# EAGLE design notes2d2 (EAGLE 9.4.1)
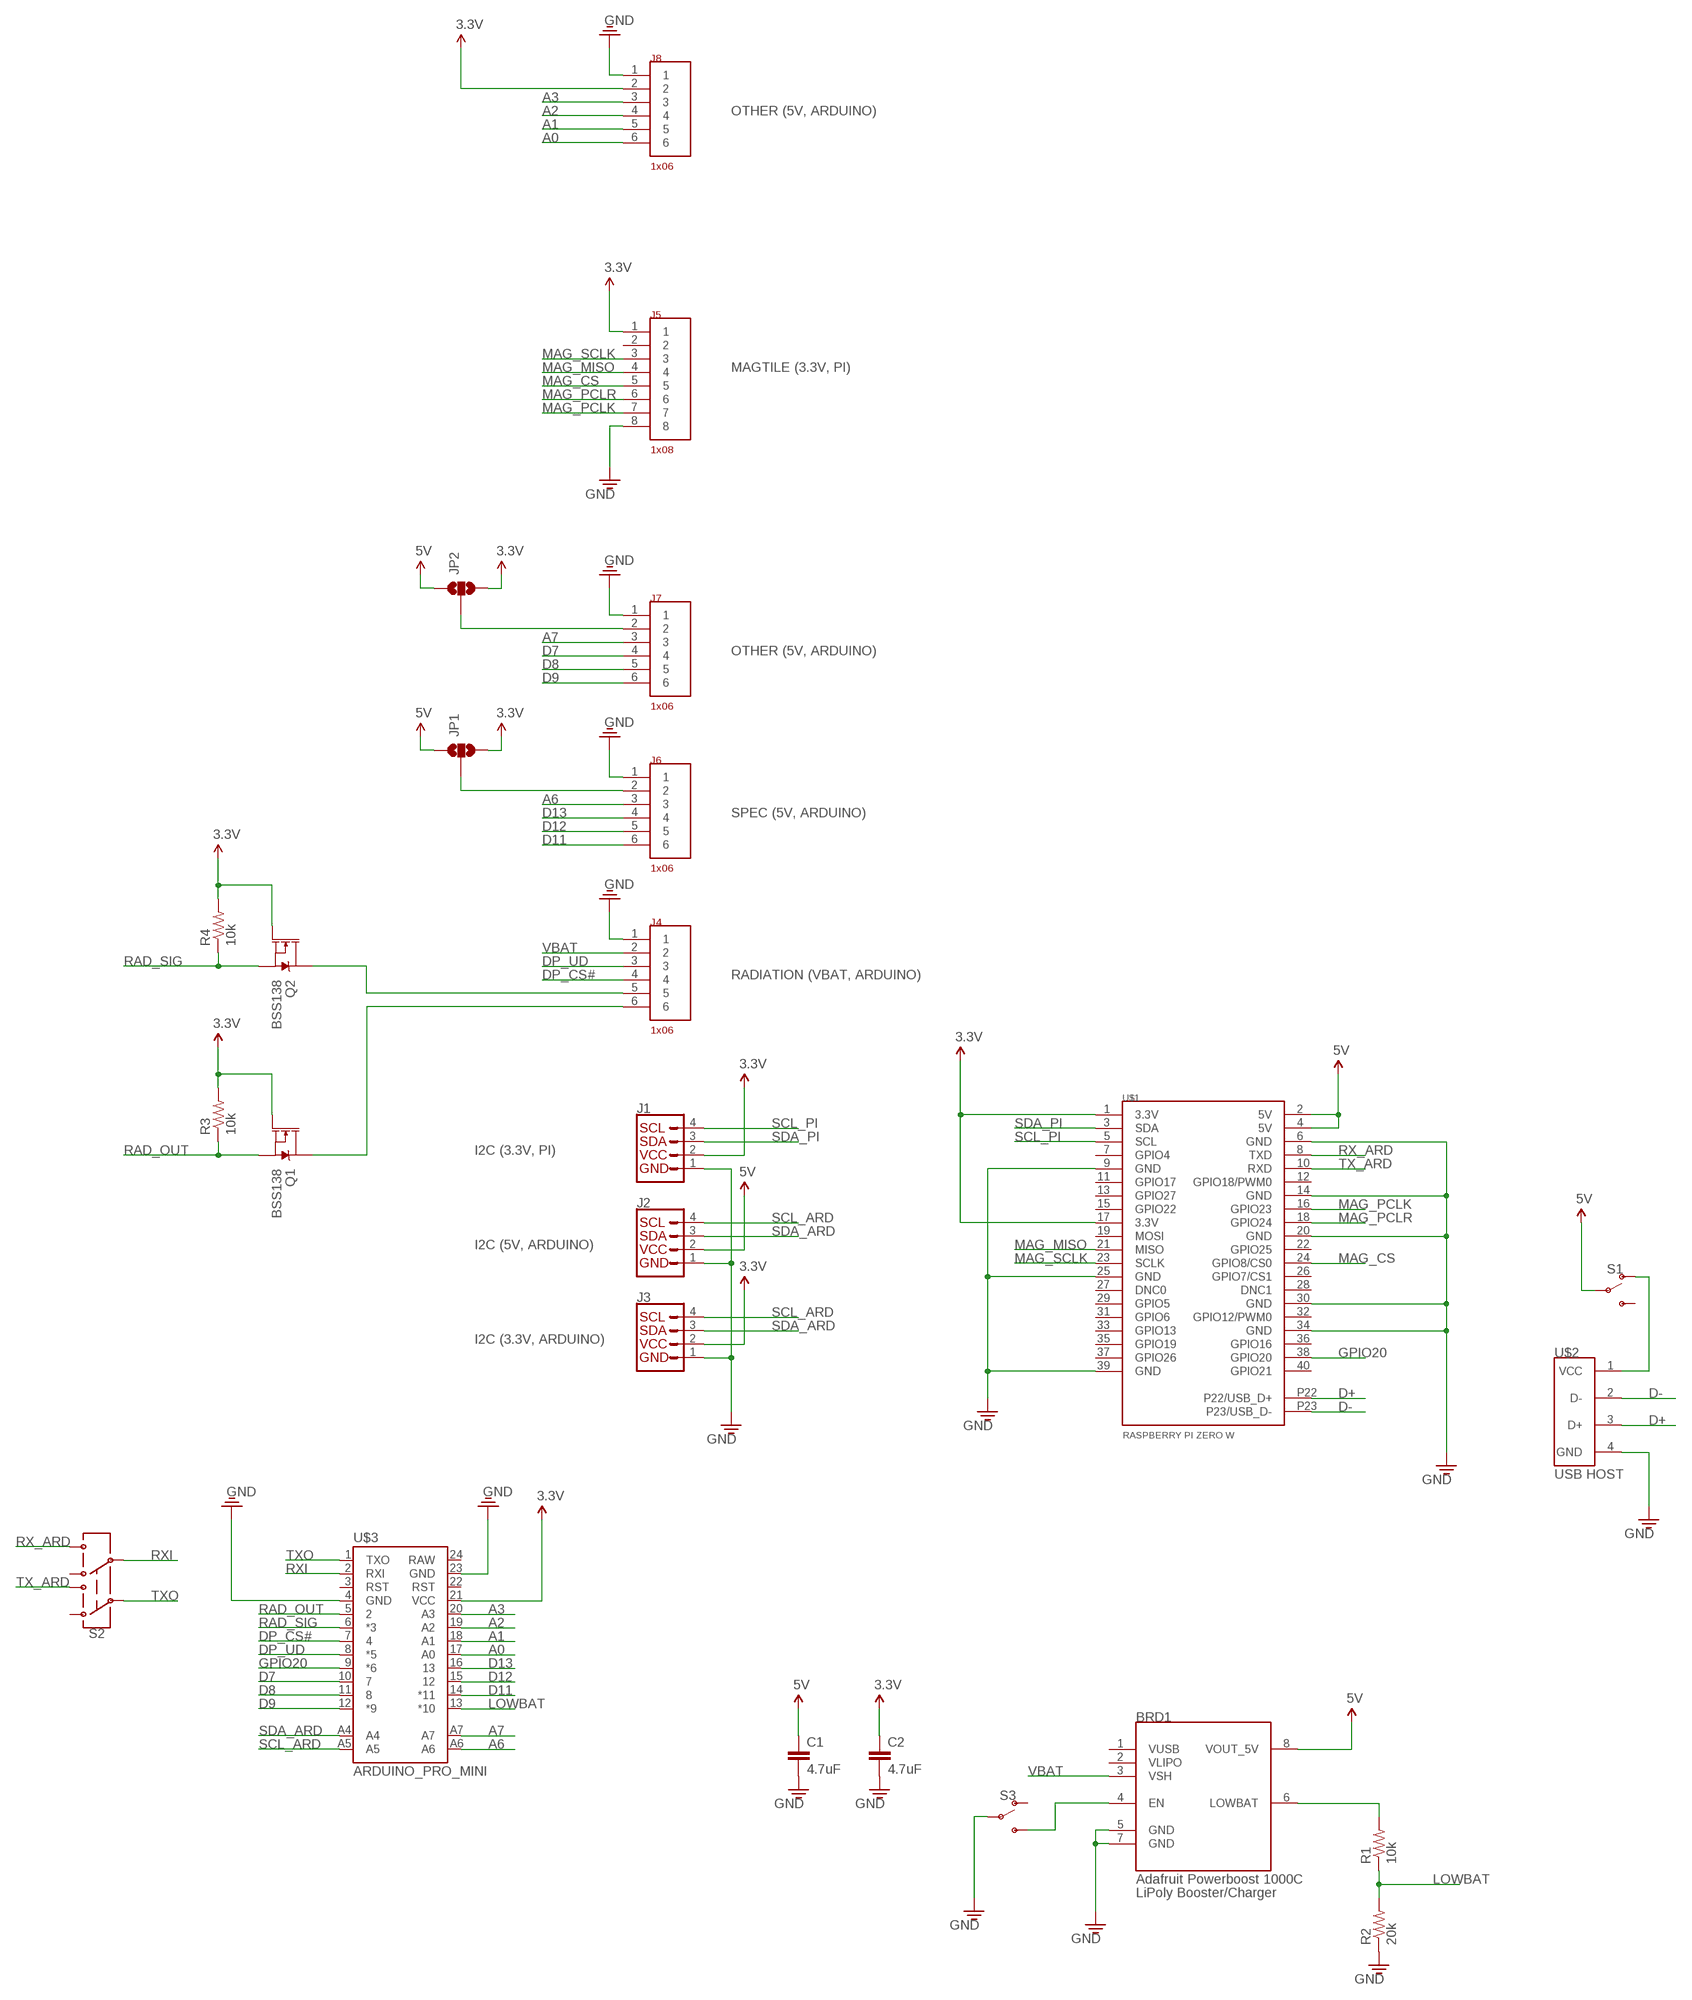
[diagram p0: schematic, sheet 1]

## Parts
BRD1  ADAFRUIT_POWERBOOST_1000C  [ADAFRUIT_POWERBOOST_1000C]
C1  4.7uF  CAP0603  [0603]
C2  4.7uF  CAP0603  [0603]
J1  QWIIC_CONNECTORJS-1MM  [1X04_1MM_RA]
J2  QWIIC_CONNECTORJS-1MM  [1X04_1MM_RA]
J3  QWIIC_CONNECTORJS-1MM  [1X04_1MM_RA]
J4  1X06  [JST-SM06B-1MM]
J5  1X08  [JST-SM08B-1MM]
J6  1X06  [JST-SM06B-1MM]
J7  1X06  [JST-SM06B-1MM]
J8  1X06  [JST-SM06B-1MM]
JP1  JUMPER-SMT_3_NO_SILK  [SMT-JUMPER_3_NO_SILK]
JP2  JUMPER-SMT_3_NO_SILK  [SMT-JUMPER_3_NO_SILK]
Q1  BSS138  MOSFET-NCH-BSS138  [SOT23-3]
Q2  BSS138  MOSFET-NCH-BSS138  [SOT23-3]
R1  10k  RESISTOR0603  [0603]
R2  20k  RESISTOR0603  [0603]
R3  10k  RESISTOR0603  [0603]
R4  10k  RESISTOR0603  [0603]
S1  SWITCH-SPDT-SMD-RIGHT-ANGLE  [SWITCH_SPST_SMD_A]
S2  SWITCH-DPDT-SMD-AYZ0202  [SWITCH_DPDT_SMD_AYZ0202]
S3  SWITCH-SPDT-SMD-RIGHT-ANGLE  [SWITCH_SPST_SMD_A]
U$1  RASPBERRY-PI-ZEROW-USB  [RASPBERRY-PI-ZEROW-USB]
U$2  USB-HOST  [1-292303-6]
U$3  ARDUINO_PRO_MINI  [ARDUINO_PRO_MINI]

## Nets
3.3V: C2.1 J1.2(VCC) J3.2(VCC) J5.1 J8.2 JP1.3 JP2.3 Q1.1(G) Q2.1(G) R3.2 R4.2 U$1.1(3.3V) U$1.17(3.3V) U$3.21(VCC)
5V: BRD1.8(VOUT_5V) C1.1 J2.2(VCC) JP1.1 JP2.1 S1.2(P) U$1.2(5V) U$1.4(5V)
A0: J8.6 U$3.17(A0)
A1: J8.5 U$3.18(A1)
A2: J8.4 U$3.19(A2)
A3: J8.3 U$3.20(A3)
A6: J6.3 U$3.A6
A7: J7.3 U$3.A7
D7: J7.4 U$3.10
D8: J7.5 U$3.11
D9: J7.6 U$3.12(*9)
D11: J6.6 U$3.14(*11)
D12: J6.5 U$3.15
D13: J6.4 U$3.16
D+: U$1.P22(P22/USB_D+) U$2.3(D+)
D-: U$1.P23(P23/USB_D-) U$2.2(D-)
DP_CS#: J4.4 U$3.7
DP_UD: J4.3 U$3.8(*5)
GND: BRD1.5(GND) BRD1.7(GND) C1.2 C2.2 J1.1(GND) J2.1(GND) J3.1(GND) J4.1 J5.8 J6.1 J7.1 J8.1 R2.1 S3.2(P) U$1.6(GND) U$1.9(GND) U$1.14(GND) U$1.20(GND) U$1.25(GND) U$1.30(GND) U$1.34(GND) U$1.39(GND) U$2.4(GND) U$3.4(GND) U$3.23(GND)
GPIO20: U$1.38(GPIO20) U$3.9(*6)
LOWBAT: R1.1 R2.2 U$3.13(*10)
MAG_CS: J5.5 U$1.24(GPIO8/CS0)
MAG_MISO: J5.4 U$1.21(MISO)
MAG_PCLK: J5.7 U$1.16(GPIO23)
MAG_PCLR: J5.6 U$1.18(GPIO24)
MAG_SCLK: J5.3 U$1.23(SCLK)
N$1: BRD1.4(EN) S3.3(S)
N$2: J7.2 JP2.2
N$3: J6.2 JP1.2
N$4: J4.5 Q2.3(D)
N$5: J4.6 Q1.3(D)
N$8: BRD1.6(LOWBAT) R1.2
N$29: S1.1(O) U$2.1(VCC)
RAD_OUT: Q1.2(S) R3.1 U$3.5
RAD_SIG: Q2.2(S) R4.1 U$3.6(*3)
RX_ARD: S2.6 U$1.8(TXD)
RXI: S2.5 U$3.2(RXI)
SCL_ARD: J2.4(SCL) J3.4(SCL) U$3.A5
SCL_PI: J1.4(SCL) U$1.5(SCL)
SDA_ARD: J2.3(SDA) J3.3(SDA) U$3.A4
SDA_PI: J1.3(SDA) U$1.3(SDA)
TX_ARD: S2.3 U$1.10(RXD)
TXO: S2.2 U$3.1(TXO)
VBAT: BRD1.3(VSH) J4.2
Unconnected: BRD1.1(VUSB) BRD1.2(VLIPO) J5.2 S1.3(S) S2.1 S2.4 S3.1(O) U$1.7(GPIO4) U$1.11(GPIO17) U$1.12(GPIO18/PWM0) U$1.13(GPIO27) U$1.15(GPIO22) U$1.19(MOSI) U$1.22(GPIO25) U$1.26(GPIO7/CS1) U$1.27(DNC0) U$1.28(DNC1) U$1.29(GPIO5) U$1.31(GPIO6) U$1.32(GPIO12/PWM0) U$1.33(GPIO13) U$1.35(GPIO19) U$1.36(GPIO16) U$1.37(GPIO26) U$1.40(GPIO21) U$3.3(RST) U$3.22(RST) U$3.24(RAW)

## Notes on the sheet
- OTHER (5V, ARDUINO)
- MAGTILE (3.3V, PI)
- OTHER (5V, ARDUINO)
- SPEC (5V, ARDUINO)
- RADIATION (VBAT, ARDUINO)
- I2C (3.3V, PI)
- I2C (5V, ARDUINO)
- I2C (3.3V, ARDUINO)

## Library data of the parts
BRD1 = opensensinglab:ADAFRUIT_POWERBOOST_1000C
C1 C2 = opensensinglab:CAP: Capacitor Standard 0603 ceramic capacitor, and 0.1" leaded capacitor.
J1-J3 = SparkFun-Connectors:QWIIC_CONNECTOR: SparkFun I2C Standard Qwiic Connector An SMD 1mm pitch JST connector makes it easy and quick (get it? Qwiic?) to connect I2C devices to each other. The Qwiic system <http://www.sparkfun.com/qwiic> enables fast and solderless connection between popular platforms and various sensors and actuators. We carry 200mm <https://www.sparkfun.com/products/14204>, 100mm <https://www.sparkfun.com/products/14205>, 50mm <https://www.sparkfun.com/products/14206>, and breadboard friendly <https://www.sparkfun.com/products/14207> Qwiic cables. We also offer 10 pcs strips <https://www.sparkfun.com/products/14323> the SMD connectors.
J4 J6-J8 = notes:1X06
J5 = notes:1X08
JP1 JP2 = SparkFun-Jumpers:JUMPER-SMT_3_NO: Normally open jumper This jumper has three pads in close proximity to each other. Apply solder to close the connection(s).
Q1 Q2 = SparkFun-DiscreteSemi:MOSFET-NCH: N-channel MOSFETs Voltage controlled devices that allow control of high current outputs. SparkFun Products: SparkFun OpenScale <https://www.sparkfun.com/products/13261> SparkFun Digital Sandbox <https://www.sparkfun.com/products/12651> SparkFun Monster Moto Shield <https://www.sparkfun.com/products/10182> SparkFun MOSFET Power Controller <https://www.sparkfun.com/products/11214>; PROD_ID: TRANS-00830; VALUE: 220mA/50V/3.5Ω
R1-R4 = opensensinglab:RESISTOR: Resistor Basic schematic elements and footprints for 0603, 1206, and PTH 1/10th watt (small) resistors.
S1 S3 = SparkFun-Switches:SWITCH-SPDT: Single Pole, Double Throw (SPDT) Switch Single-pole, double-throw (SPDT) switch. Variant Overview SMD-AYZ0202 Surface Mount DPDT Switch <https://www.sparkfun.com/products/597> (COM-00597) Used on e.g. LilyPad Arduino USB - ATmega32U4 Board <https://www.sparkfun.com/products/12049> PTH-11.6X4.0MM SPDT Mini Power Switch <https://www.sparkfun.com/products/102> (COM-00102) Used on e.g. SparkFun Simon Says - Through-Hole Soldering Kit <https://www.sparkfun.com/products/10547> (KIT-10547) PTH-11.6X4.0MM-KIT KIT version of SPDT Mini Power Switch - Simplifies soldering by removing tStop of switch pins - only one side can be soldered. PTH-11.6X4.0MM-LOCK LOCK version of SPDT Mini Power Switch - Offset pins hold switch in place for easier soldering. SMD-RIGHT-ANGLE Surface Mount Right Angle Switch <https://www.sparkfun.com/products/10860> (COM-10860) Used on e.g. SparkFun ESP8266 Thing <https://www.sparkfun.com/products/13231>; PROD_ID: SWCH-10651; SF_SKU: COM-10860
S2 = SparkFun-Switches:SWITCH-DPDT: Double-Pole, Double-Throw (DPDT) Switch Double-pole, double-throw switches. Variant Overview PTH-GPI-152-3013 Used on SparkFun Geiger Counter <https://www.sparkfun.com/products/11345> SMD-AY0202 Surface Mount DPDT Switch <https://www.sparkfun.com/products/597> (COM-00597) Used on e.g. LilyPad Arduino USB - ATmega32U4 Board <https://www.sparkfun.com/products/12049>; PROD_ID: SWCH-08179; SF_SKU: COM-00597
U$1 = raspberry-pi-zero-w:RASPBERRY-PI-ZEROW-USB: Raspberry Pi Zero W, flush mount to board with USB castellation
U$2 = raspberry-pi-zero-w:USB-HOST: TE 1-292303-6
U$3 = raspberry-pi-zero-w:ARDUINO_PRO_MINI

## Board
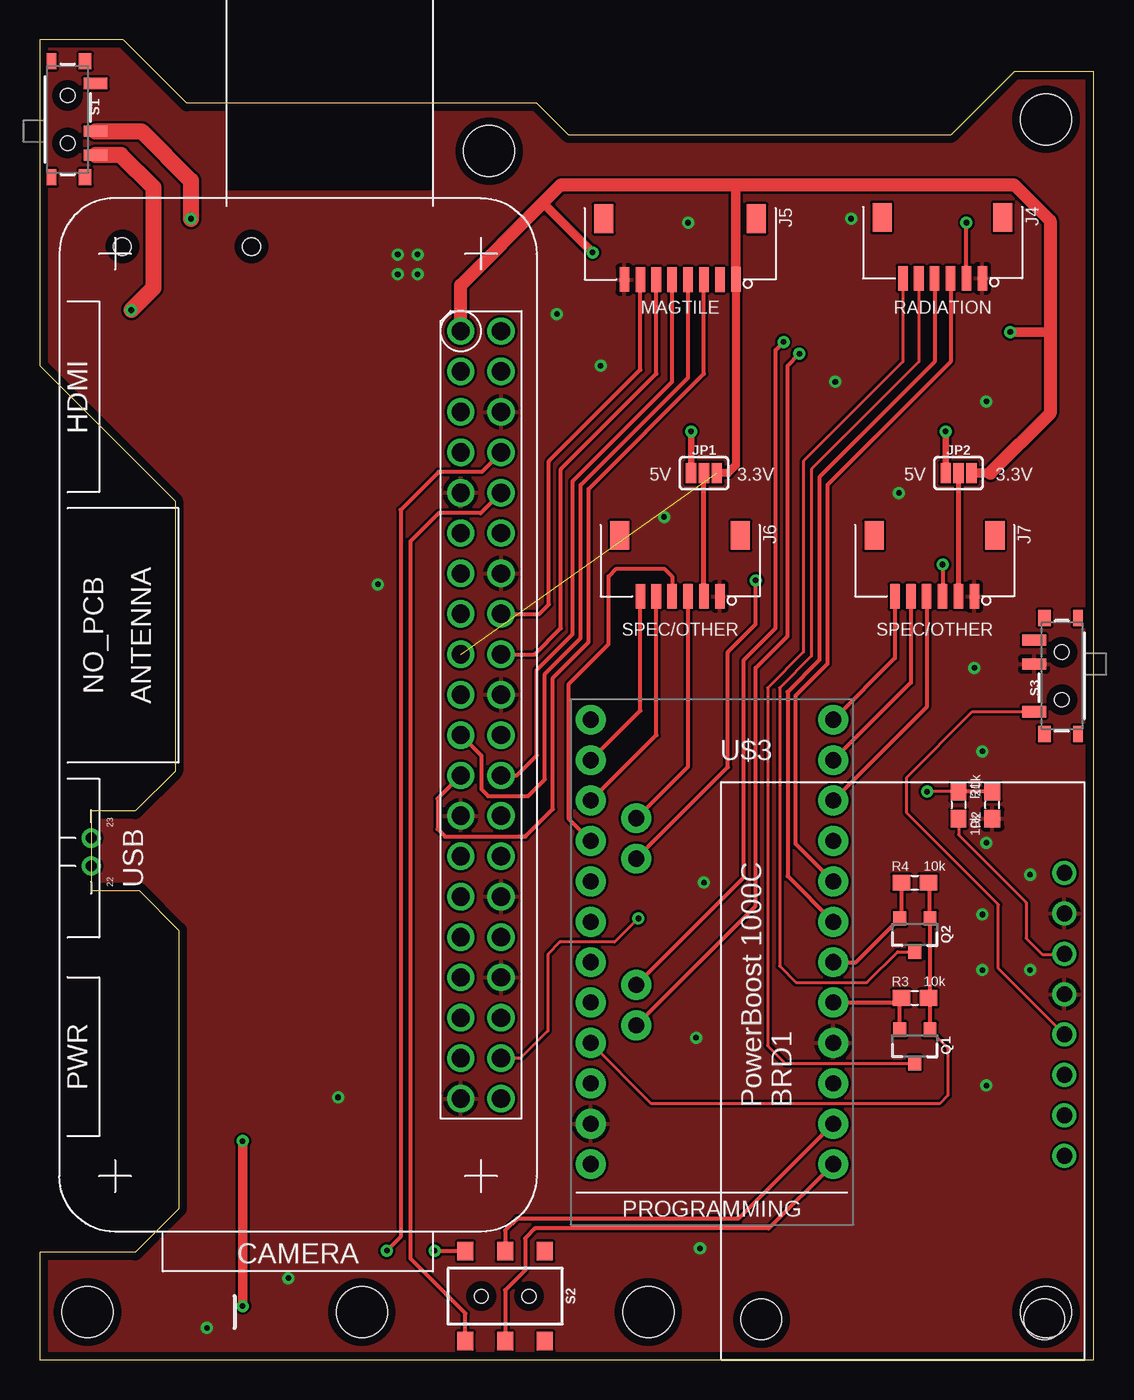
[diagram p1: board, top side]
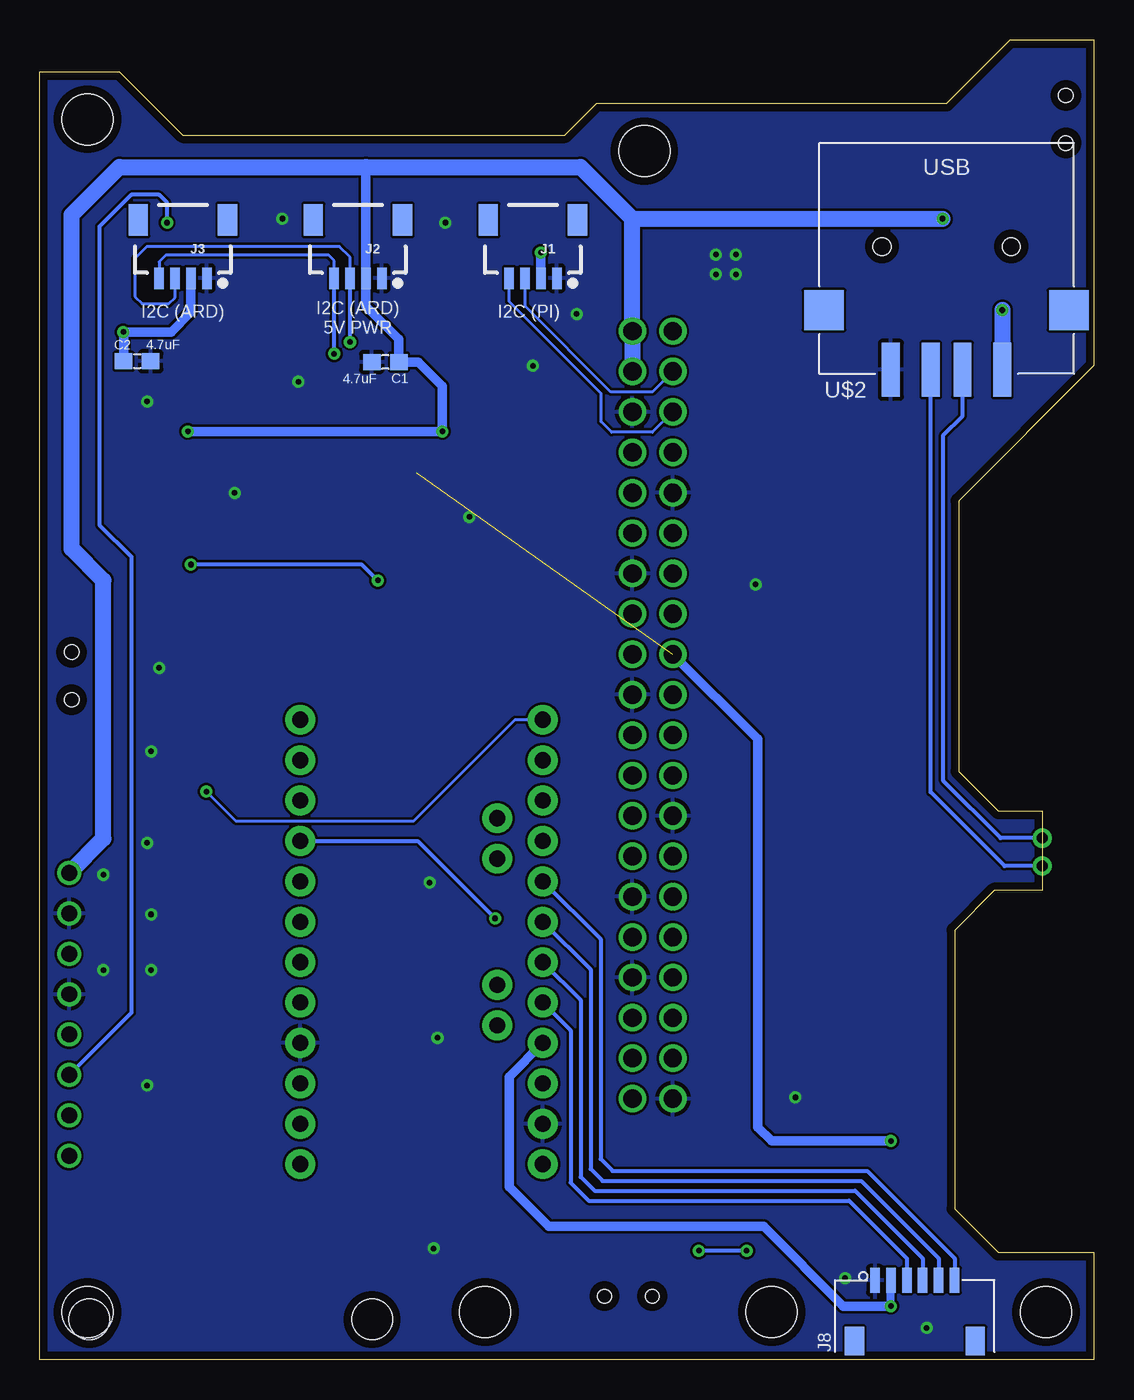
[diagram p2: board, bottom side, seen from below]

Size 66.25 x 83 mm. Coordinates in mm from the lower left corner, seen from the top.
Outline: 0,0 66.25,0 66.25,81 61.25,81 57.25,77 33.25,77 31.25,79 9.25,79 5.25,83 0,83 0,62.5 8.5,54 8.5,37 6,34.5 3.25,34.5 3.25,29.5 6.25,29.5 8.75,27 8.75,9.5 6,6.75 0,6.75 0,0
Copper layers (1*16): Top 0.035mm / dielectric 1.5mm / Bottom 0.035mm
Design rules "default *": minimum track width 6mil, minimum drill 0.35mm, track to track 6mil, track to pad 6mil, pad to pad 6mil, via to via 6mil, smd to smd 6mil, copper to edge 20mil, drill to drill 6mil, minimum pad ring 10mil, minimum via ring 8mil, stop-mask expansion 4mil, vias tented up to drill 20mil, thermal gap 10mil
Holes 3.2 mm at 3,3 20.25,3 38.25,3 63.25,3 63.25,78 28.25,76
bKeepout: area 0.2,6 to 62.2,58

### Footprints (pad centres in the part's own frame; a part is rotated, then mirrored left to right if it is on the bottom)
ADAFRUIT_POWERBOOST_1000C = drill 1: 1 12.827,-10.16; 2 15.367,-10.16; 3 17.907,-10.16; 4 20.447,-10.16; 5 22.987,-10.16; 6 25.527,-10.16; 7 28.067,-10.16; 8 30.607,-10.16 | hole 2.54: 2.54,-8.89; 2.54,8.89
0603 = smd 1.1 x 1: 1 -0.85,0; 2 0.85,0
1X04_1MM_RA = smd 0.6 x 1.35: 1 -1.5,0; 2 -0.5,0; 3 0.5,0; 4 1.5,0 | smd 1.2 x 2: NC1 2.8,-3.675; NC2 -2.8,-3.675
JST-SM06B-1MM = smd 0.6 x 1.55: 1 -2.5,0; 2 -1.5,0; 3 -0.5,0; 4 0.5,0; 5 1.5,0; 6 2.5,0 | smd 1.2 x 1.8: SHIELD1 -3.79,-3.83; SHIELD2 3.8,-3.83
JST-SM08B-1MM = smd 0.6 x 1.55: 1 -3.5,5.075; 2 -2.5,5.08; 3 -1.5,5.08; 4 -0.5,5.08; 5 0.5,5.08; 6 1.5,5.08; 7 2.5,5.08; 8 3.5,5.075 | smd 1.2 x 1.8: SHIELD1 -4.79,1.25; SHIELD2 4.8,1.25
SMT-JUMPER_3_NO_SILK = smd 0.635 x 1.27: 1 -0.813,0; 2 0,0; 3 0.813,0
SOT23-3 = smd 0.8 x 0.9: 1 -0.95,-1; 2 0.95,-1; 3 0,1.1
SWITCH_SPST_SMD_A = smd 0.7 x 1.5: 1 -2.25,-1.75; 2 -0.75,-1.75; 3 2.25,-1.75 | smd 1 x 0.6: GND1 -3.65,1; GND3 3.65,1 | smd 1 x 0.8: GND2 -3.65,-1.1; GND4 3.65,-1.1 | hole 0.9: -1.5,0; 1.5,0
SWITCH_DPDT_SMD_AYZ0202 = smd 1 x 1.15: 1 -2.5,2.825; 2 0,2.825; 3 2.5,2.825; 4 -2.5,-2.825; 5 0,-2.825; 6 2.5,-2.825 | hole 0.85: 1.5,0; -1.5,0
RASPBERRY-PI-ZEROW-USB = drill 1.15: 1 -24.13,-1.27; 2 -24.13,1.27; 3 -21.59,-1.27; 4 -21.59,1.27; 5 -19.05,-1.27; 6 -19.05,1.27; 7 -16.51,-1.27; 8 -16.51,1.27; 9 -13.97,-1.27; 10 -13.97,1.27; 11 -11.43,-1.27; 12 -11.43,1.27; 13 -8.89,-1.27; 14 -8.89,1.27; 15 -6.35,-1.27; 16 -6.35,1.27; 17 -3.81,-1.27; 18 -3.81,1.27; 19 -1.27,-1.27; 20 -1.27,1.27; 21 1.27,-1.27; 22 1.27,1.27; 23 3.81,-1.27; 24 3.81,1.27; 25 6.35,-1.27; 26 6.35,1.27; 27 8.89,-1.27; 28 8.89,1.27; 29 11.43,-1.27; 30 11.43,1.27; 31 13.97,-1.27; 32 13.97,1.27; 33 16.51,-1.27; 34 16.51,1.27; 35 19.05,-1.27; 36 19.05,1.27; 37 21.59,-1.27; 38 21.59,1.27; 39 24.13,-1.27; 40 24.13,1.27 | drill 0.7: P22 9.5,-24.5; P23 7.75,-24.5
1-292303-6 = smd 1.12 x 3.39: 1 -3.5,7.75; 2 -1,7.75; 3 1,7.75; 4 3.5,7.75 | smd 2.5 x 2.5: M1 -7.7,4; M2 7.7,4 | hole 1.1: -4.06,0; 4.06,0
ARDUINO_PRO_MINI = drill 1.016 pad 1.88: 1 -7.62,12.7; 2 -7.62,10.16; 3 -7.62,7.62; 4 -7.62,5.08; 5 -7.62,2.54; 6 -7.62,0; 7 -7.62,-2.54; 8 -7.62,-5.08; 9 -7.62,-7.62; 10 -7.62,-10.16; 11 -7.62,-12.7; 12 -7.62,-15.24; 13 7.62,-15.24; 14 7.62,-12.7; 15 7.62,-10.16; 16 7.62,-7.62; 17 7.62,-5.08; 18 7.62,-2.54; 19 7.62,0; 20 7.62,2.54; 21 7.62,5.08; 22 7.62,7.62; 23 7.62,10.16; 24 7.62,12.7; A4 4.763,1.429; A5 4.763,3.969; A6 4.763,-9.049; A7 4.763,-6.509

### Placement (x,y rotation side)
BRD1  54.25,0 90 top
C1  44.53,62.74 180 bottom
C2  60.12,62.79 0 bottom
J1  35.25,68 180 bottom
J2  46.25,68 180 bottom
J3  57.25,68 180 bottom
J4  56.75,68 180 top
J5  40.25,73 180 top
J6  40.25,48 180 top
J7  56.25,48 180 top
J8  11.25,5 0 bottom
JP1  41.75,55.75 0 top
JP2  57.75,55.75 0 top
Q1  55,19.75 180 top
Q2  55,26.75 180 top
R1  57.75,34.88 270 top
R2  59.88,34.88 90 top
R3  55,22.75 0 top
R4  55,30 0 top
S1  1.75,78 90 top
S2  29.25,4 180 top
S3  64.25,43 270 top
U$1  27.73,40.55 270 top
U$2  9.25,70 180 bottom
U$3  42.25,25 180 top

### Tracks (layer width: path | path; a pad name or v marks a point on that pad's centre or on a via)
3.3V  (via drill 0.35)  (1 unrouted)
  Top 0.203: Q1.1 57.08,19.62 57.08,16.61 56.57,16.1 38.45,16.1 U$3.21
  Top 0.254: Q1.1 55.95,22.65 R3.2 55.95,22.85 Q2.1 55.95,29.9 R4.2
  Top 0.508: J5.1 43.75,56.25 43.25,55.75 JP1.3
  Top 0.61: v12.75,13.75 v12.75,3.38 | JP2.3 59.75,55.75 | J5.1 43.75,73.88 | v34.75,69.62 31.69,72.69 31.69,72.81 | v61,64.62 63.5,64.62
  Top 0.813: U$1.1 26.46,67.58 31.69,72.81 32.75,73.88 43.75,73.88 61.25,73.88 63.5,71.62 63.5,64.62 63.5,59.5 59.75,55.75
  Bottom 0.508: v12.75,3.38 J8.2
  Bottom 0.61: U$1.17 21.12,39.02 21.12,14.62 20.25,13.75 v12.75,13.75 | U$3.21 36.75,17.8 36.75,10.88 34.25,8.38 20.75,8.38 15.75,3.38 v12.75,3.38 | J1.2 v34.75,69.62 | J3.2 56.75,65.88 58,64.62 v61,64.62 60.97,64.6 C2.1
5V  (via drill 0.35)
  Top 0.406: v40.94,58.38 JP1.1 | JP2.1 v56.94,58.38
  Top 0.61: JP1.1
  Top 1.016: S1.2 6.4,77.25 9.5,74.15 v9.5,71.75
  Bottom 0.61: 45.75,75 J2.2 45.75,66.25 43.68,64.18 C1.1 42.45,62.74 40.94,61.23 v40.94,58.38 v56.94,58.38
  Bottom 1.016: BRD1.8 62.25,32.77 62.25,49 64.25,51 64.25,72 61.25,75 45.75,75 32.25,75 29,71.75 | 29,71.75 U$1.2 U$1.4 | 29,71.75 v9.5,71.75
A0
  Bottom 0.254: U$3.17 31,26.45 31,12.62 30.25,11.88 14.25,11.88 8.75,6.38 J8.6
A1
  Bottom 0.254: U$3.18 31.62,24.54 31.62,12 30.88,11.25 14.62,11.25 9.75,6.38 J8.5
A2
  Bottom 0.254: U$3.19 32.25,22.62 32.25,11.5 31.38,10.62 15,10.62 10.75,6.38 J8.4
A3
  Bottom 0.254: U$3.20 32.88,20.7 32.88,11.12 31.75,10 15.38,10 11.75,6.38 J8.3
A6
  Top 0.254: U$3.A6 40.75,37.31 J6.3
A7  (via drill 0.35)
  Top 0.254: U$3.A7 43.25,37.27 43.25,44.5 45,46.25 v45,49 | v56.75,50 J7.3
  Bottom 0.254: v45,49 46,50 v56.75,50
D7
  Top 0.254: J7.4 55.75,41.04 U$3.10
D8
  Top 0.254: J7.5 54.75,42.58 U$3.11
D9
  Top 0.254: J7.6 53.75,44.12 U$3.12
D11
  Top 0.254: U$3.14 37.75,40.82 J6.6
D12
  Top 0.254: U$3.15 38.75,39.28 J6.5
D13
  Top 0.254: U$3.16 33.25,34 33.25,42.5 35.75,45 35.75,49.25 36.25,49.75 39.25,49.75 39.75,49.25 J6.4
D+
  Bottom 0.254: U$1.P22 5.6,31.05 10.25,35.7 U$2.3
D-
  Bottom 0.254: U$1.P23 5.85,32.8 9.45,36.4 9.45,58.15 8.25,59.35 U$2.2
DP_CS#
  Top 0.254: J4.4 56.25,62.75 49,55.5 49,44 47,42 47,30.41 U$3.7
DP_UD
  Top 0.254: J4.3 57.25,62.75 49.5,55 49.5,43.75 47.5,41.75 47.5,32.45 U$3.8
GND  (via drill 0.35)
  other vias: 15.62,5.12 41.25,20.25 41.75,30 39.25,53 54,54.5 50,61.5 35.25,62.5 32.5,65.75 40.75,71.5 51,71.75 59.5,60.25 58.75,43.5 59.25,38.25 59.5,17.25 18.75,16.5 21.25,48.75 10.5,2 41.5,7 23.75,69.5 22.5,69.5 23.75,68.25 22.5,68.25 62.25,30.5 62.25,24.5 59.25,28 59.25,24.5 59.5,32.5
  pour Bottom: -1.75,0 -1.75,83 66.25,83 66.25,0
  pour Top: -1.75,0 -1.75,83 66.25,83 66.25,0
GPIO20  (via drill 0.35)
  Top 0.203: v37.62,27.75 36.14,26.26 32.69,26.26 31.93,25.5 31.93,20.68 30.2,18.95 29.01,18.95 U$1.38
  Bottom 0.254: U$3.9 42.49,32.62 v37.62,27.75
LOWBAT  (via drill 0.35)
  Top 0.203: R1.1 v55.77,35.73
  Top 0.254: R2.2 R1.1
  Bottom 0.203: v55.77,35.73 53.92,33.88 42.75,33.88 36.38,40.25 U$3.13
MAG_CS
  Top 0.254: U$1.24 29.99,36.74 31.25,38 31.25,43.38 33.5,45.62 33.5,55.25 39.75,61.5 J5.5
MAG_MISO
  Top 0.254: U$1.21 27.75,37.99 27.75,35.88 28.18,35.45 30.7,35.45 31.75,36.5 31.75,43.12 34,45.38 34,55 40.75,61.75 J5.4
MAG_PCLK
  Top 0.254: U$1.16 31.4,46.9 32,47.5 32,56.5 37.75,62.25 J5.7
MAG_PCLR
  Top 0.254: U$1.18 31.11,44.36 32.75,46 32.75,56 38.75,62 J5.6
MAG_SCLK
  Top 0.254: U$1.23 25,35.28 25,33.38 25.48,32.9 30.52,32.9 32.25,34.62 32.25,42.88 34.5,45.12 34.5,54.75 41.75,62 J5.3
N$1
  Top 0.203: BRD1.4 60.25,24.61 60.25,28.62 54.5,34.38 54.5,36.62 58.62,40.75 S3.3
N$2
  Top 0.305: J7.2 JP2.2
N$3
  Top 0.305: J6.2 JP1.2
N$4
  Top 0.203: J4.5 55.25,62.75 48.5,56 48.5,44.25 46.5,42.25 46.5,24.75 47.53,23.72 52,23.72 53.93,25.65 Q2.3
N$5
  Top 0.203: J4.6 54.25,62.75 48,56.5 48,44.5 45.75,42.25 45.75,19.75 46.86,18.64 Q1.3
N$8
  Top 0.203: R1.2 57.75,33 62,28.75 62,26.5 63,25.5 64.38,25.5 BRD1.6
N$29  (via drill 0.35)
  Top 1.016: v5.75,66 7.15,67.4 7.15,73.7 5.1,75.75 S1.1
  Bottom 1.016: v5.75,66 U$2.1
RAD_OUT
  Top 0.254: Q1.2 54.05,22.65 R3.1 53.86,22.46 U$3.5
RAD_SIG
  Top 0.254: R4.1 54.15,27.85 Q2.2 51.3,25 U$3.6
RX_ARD  (via drill 0.35)
  Top 0.254: U$1.8 27.77,55.83 25.07,55.83 22.68,53.44 22.68,7.72 v21.82,6.86 | v24.82,6.86 26.72,6.86 S2.6
  Bottom 0.254: v21.82,6.86 v24.82,6.86
RXI
  Top 0.254: U$3.2 43.91,8.88 30,8.88 29.25,8.12 S2.5
SCL_ARD  (via drill 0.35)
  Top 0.254: U$3.A5 45,28.54 45,43.5 47,45.5 47,62.5 v47.75,63.25
  Bottom 0.203: J2.4 47.75,69.11 48.09,69.44 58.35,69.44 58.75,69.04 J3.4
  Bottom 0.254: v47.75,63.25 J2.4
SCL_PI
  Bottom 0.203: U$1.5 27.74,58.32 30.3,58.32 30.97,58.98 30.97,60.76 36.75,66.54 J1.4
SDA_ARD  (via drill 0.35)
  Top 0.254: U$3.A4 44.25,30.33 44.25,44 46.25,46 46.25,63.5 v46.75,64
  Bottom 0.203: J2.3 46.75,69.33 47.42,70 59.52,70 60.28,69.24 60.28,66.85 59.82,66.4 58.14,66.4 57.75,66.79 J3.3
  Bottom 0.254: v46.75,64 J2.3
SDA_PI
  Bottom 0.203: U$1.3 27.74,60.86 30.36,60.86 35.75,66.25 J1.3
TX_ARD
  Top 0.254: U$1.10 27.72,53.24 25.07,53.24 23.29,51.46 23.29,6.37 26.75,2.91 S2.3
TXO
  Top 0.254: U$3.1 45.82,8.25 31.12,8.25 30.5,7.62 30.5,5.62 29.25,4.38 S2.2
VBAT  (via drill 0.35)
  Top 0.254: J4.2 v58.25,71.5
  Bottom 0.254: v58.25,71.5 58.25,72.75 58.75,73.25 60.5,73.25 62.5,71.25 62.5,52.5 60.5,50.5 60.5,21.82 BRD1.3

### Text on the board
tPlace: MAGTILE | RADIATION | 5V | 3.3V | 5V | 3.3V | SPEC/OTHER | SPEC/OTHER
bPlace: I2C (PI) | I2C (ARD) | I2C (ARD) / 5V PWR